# EAGLE schematic Audio2Trig (EAGLE 7.7.0)
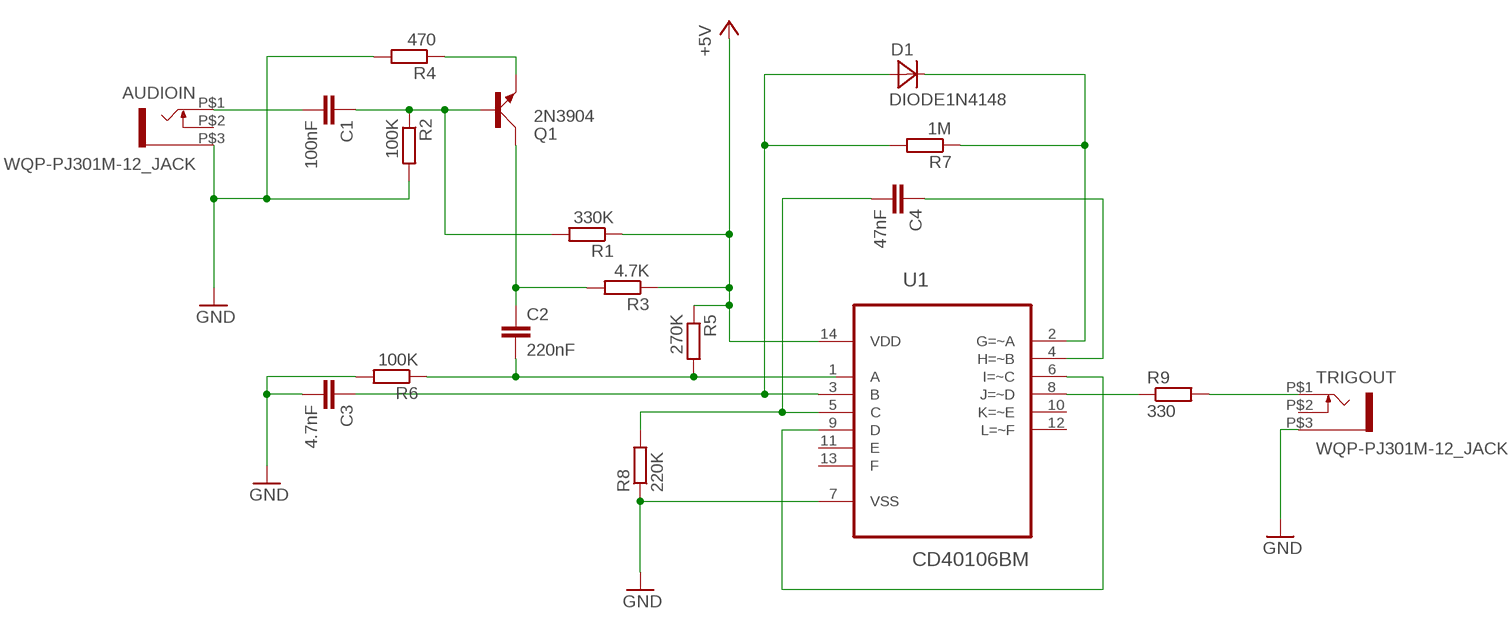
[diagram p0: schematic, sheet 1]

## Parts
AUDIOIN  WQP-PJ301M-12_JACK  [WQP-PJ301M-12_JACK]
C1  100nF  C-EU025-025X050  [C025-025X050]
C2  220nF  C-EU025-025X050  [C025-025X050]
C3  4.7nF  C-EU025-025X050  [C025-025X050]
C4  47nF  C-EU025-025X050  [C025-025X050]
D1  DIODE1N4148  [DO-35]
Q1  2N3904  [TO92D]
R1  330K  R-EU_0204/2V  [0204V]
R2  100K  R-EU_0204/2V  [0204V]
R3  4.7K  R-EU_0204/2V  [0204V]
R4  470  R-EU_0204/2V  [0204V]
R5  270K  R-EU_0204/2V  [0204V]
R6  100K  R-EU_0204/2V  [0204V]
R7  1M  R-EU_0204/2V  [0204V]
R8  220K  R-EU_0204/2V  [0204V]
R9  330  R-EU_0204/2V  [0204V]
TRIGOUT  WQP-PJ301M-12_JACK  [WQP-PJ301M-12_JACK]
U1  CD40106BM  [SOIC127P600X175-14N]

## Nets
+5V: R1.1 R3.1 R5.1 U1.14(VDD)
GND: AUDIOIN.P$3 C3.2 R2.2 R4.2 R6.2 R8.1 TRIGOUT.P$3 U1.7(VSS)
N$1: R9.1 U1.8(J=~D)
N$2: U1.6(I=~C) U1.9(D)
N$3: R9.2 TRIGOUT.P$1
N$4: C4.1 U1.4(H=~B)
N$5: C4.2 R8.2 U1.5(C)
N$6: C3.1 D1.+ R7.2 U1.3(B)
N$7: D1.- R7.1 U1.2(G=~A)
N$8: C2.2 R5.2 R6.1
N$9: Q1.E R4.1
N$10: AUDIOIN.P$1 C1.2
N$11: C1.1 Q1.B R1.2 R2.1
N$12: C2.1 Q1.C R3.2
Unconnected: AUDIOIN.P$2 TRIGOUT.P$2 U1.1(A) U1.10(K=~E) U1.11(E) U1.12(L=~F) U1.13(F)

## Library data of the parts
AUDIOIN TRIGOUT = thonkiconn:WQP-PJ301M-12_JACK
C1-C4 = resistorwithpads:C-EU: CAPACITOR, European symbol
D1 = Diodes:DIODE: Diode; SPICE: D{NAME} {+.NET} {-.NET} 1N4148; SPICEMOD: .model 1N4148 D (IS=0.1PA, RS=16 CJO=2PF TT=12N BV=100 IBV=1nA)
Q1 = transistor-small-signal:2N3904: NPN TRANSISTOR
R1-R9 = resistorwithpads:R-EU_: RESISTOR, European symbol
U1 = CD40106BM:CD40106BM: HEX Schimitt Trigger; MPN: CD40106BM; OC_FARNELL: 9589520; OC_NEWARK: 67K2792; PACKAGE: SOIC-14; SUPPLIER: Texas Instruments